# Altium schematic sheet Power.SchDoc
size A
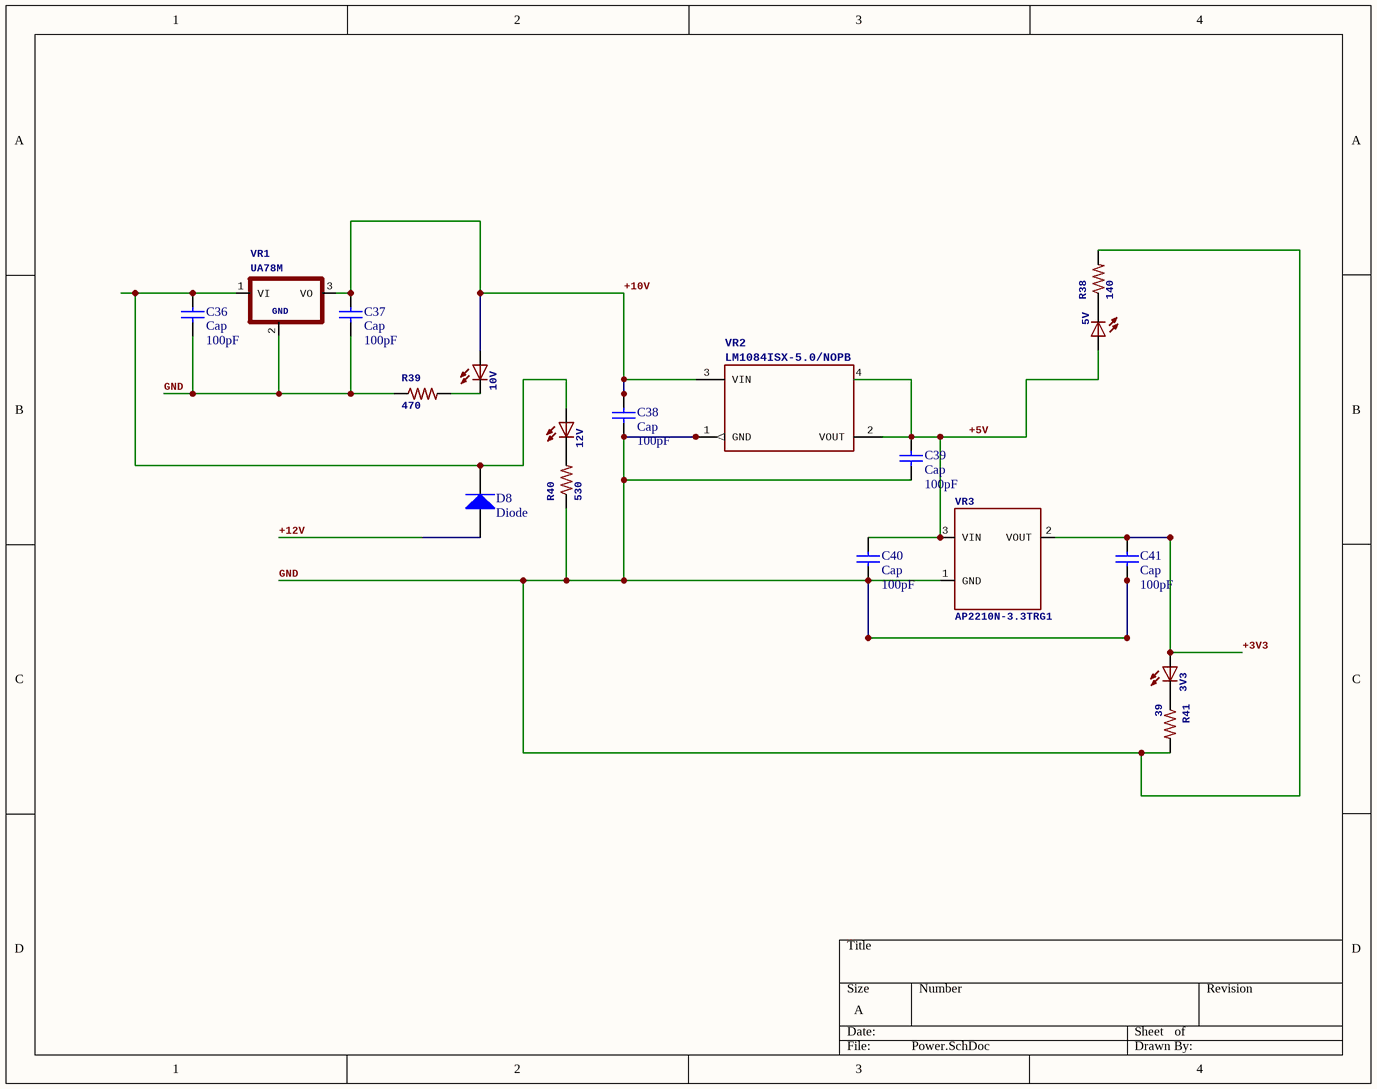
[diagram p0: Power.SchDoc]

## Parts
3V3  LED5MM  [LED5MM]  (value not drawn)
5V  LED5MM  [LED5MM]  (value not drawn)
10V  LED5MM  [LED5MM]  (value not drawn)
12V  LED5MM  [LED5MM]  (value not drawn)
C36  Cap  value 100pF  [CAPCP2012X06N]
C37  Cap  value 100pF  [CAPCP2012X06N]
C38  Cap  value 100pF  [CAPCP2012X06N]
C39  Cap  value 100pF  [CAPCP2012X06N]
C40  Cap  value 100pF  [CAPCP2012X06N]
C41  Cap  value 100pF  [CAPCP2012X06N]
D8  Diode  [DIODE-0.7]
R38  140  [RESC_0805_2012]
R39  470  [RESC_0805_2012]
R40  530  [RESC_0805_2012]
R41  39  [RESC_0805_2012]
VR1  UA78M  [UA78M]
VR2  LM1084ISX-5.0/NOPB  [LM1084ISX-5.0/NOPB]
VR3  AP2210N-3.3TRG1  [SOT95P245X110-3N]

## Nets
+3V3: 3V3.A C41.2 VR3.2(VOUT)
+5V: 5V.A C39.2 C40.2 VR2.2(VOUT) VR2.4 VR3.3(VIN)
+10V: 10V.A C37.2 C38.2 VR1.3(VO) VR2.3(VIN)
+12V: D8.1(A)
GND: C36.1 C37.1 C38.1 C39.1 C40.1 C41.1 R38.2 R39.1 R40.1 R41.2 VR1.2(GND) VR2.1(GND) VR3.1(GND)
Net3V3_K: 3V3.K(C) R41.1
Net5V_K: 5V.K(C) R38.1
Net10V_K: 10V.K(C) R39.2
Net12V_A: 12V.A C36.2 D8.2(K) VR1.1(VI)
Net12V_K: 12V.K(C) R40.2

## Library data of the parts
3V3 5V 10V 12V = LED5MM: LEDOSRAM:- CHIPLEDLG R971, LG N971, LY N971, LG Q971, LY Q971, LO R971, LY R971 LH N974, LH R974LS Q976, LO Q976, LY Q976LO Q996- Hyper CHIPLEDLW Q18SLB Q993, LB Q99A, LB R99A- SideLEDLS A670, LO A670, LY A670, LG A670, LP A670LB A673, LV A673, LT A673, LW A673LH A674LY A675LS A676, LA A676, LO A676, LY A676, LW A676LS A679, LY A679, LG A679-  Hyper Micro SIDELEDÂ®LS Y876, LA Y876, LO Y876, LY Y876LT Y87S- SmartLEDLW L88C, LW L88SLB L89C, LB L89S, LG L890LS L89K, LO L89K, LY L89KLS L896, LA L896, LO L896, LY L896- TOPLEDLS T670, LO T670, LY T670, LG T670, LP T670LSG T670, LSP T670, LSY T670, LOP T670, LYG T670LG T671, LOG T671, LSG T671LB T673, LV T673, LT T673, LW T673LH T674LS T676, LA T676, LO T676, LY T676, LB T676, LH T676, LSB T676, LW T676LB T67C, LV T67C, LT T67C, LS T67K, LO T67K, LY T67K, LW E67CLS E67B, LA E67B, LO E67B, LY E67B, LB E67C, LV E67C, LT E67CLW T67CLS T679, LY T679, LG T679LS T770, LO T770, LY T770, LG T770, LP T770LB T773, LV T773, LT T773, LW T773LH T774LS E675, LA E675, LY E675, LS T675LS T776, LA T776, LO T776, LY T776, LB T776LHGB T686LT T68C, LB T68C- Hyper Mini TOPLEDÂ®LB M676- Mini TOPLED SantanaÂ®LG M470LS M47K, LO M47K, LY M47K Source: http://www.osram.convergy.deLUXEON:- LUMILEDÂ®LXK2-PW12-R00, LXK2-PW12-S00, LXK2-PW14-U00, LXK2-PW14-V00LXK2-PM12-R00, LXK2-PM12-S00, LXK2-PM14-U00LXK2-PE12-Q00, LXK2-PE12-R00, LXK2-PE12-S00, LXK2-PE14-T00, LXK2-PE14-U00LXK2-PB12-K00, LXK2-PB12-L00, LXK2-PB12-M00, LXK2-PB14-N00, LXK2-PB14-P00, LXK2-PB14-Q00LXK2-PR12-L00, LXK2-PR12-M00, LXK2-PR14-Q00, LXK2-PR14-R00LXK2-PD12-Q00, LXK2-PD12-R00, LXK2-PD12-S00LXK2-PH12-R00, LXK2-PH12-S00LXK2-PL12-P00, LXK2-PL12-Q00, LXK2-PL12-R00 Source: www.luxeon.comKINGBRIGHT:KA-3528ASYCSource: www.kingbright.com; GateName_1: G$1; SymbolName_1: LED; DeviceName: 5MM; LibraryName: led; DeviceSetName: LED
C36-C41 = Cap: Capacitor; Published: 8-Jun-2000; LatestRevisionDate: 17-Jul-2002; LatestRevisionNote: Re-released for DXP Platform.; PackageReference: RAD-0.3; Publisher: Altium Limited; PackageDescription: Radial Cap, Thru-Hole; 2 Leads; 0.3 in Pin Spacing
D8 = Diode: Default Diode; Published: 8-Jun-2000; LatestRevisionDate: 17-Jul-2002; LatestRevisionNote: Re-released for DXP Platform.; PackageVersion: Sep-1996; PackageReference: SMC; Publisher: Altium Limited; PackageDescription: DO-214-AB/SMC; 2 C-Bend Leads; Body 7.9 x 5.9 mm, inc. leads (LxW); Code_JEDEC: DO-214-AB
R38-R41 = R-US_R0805: RESISTOR, American symbol; GateName_1: G$1; SymbolName_1: R-US; DeviceName: R0805; DeviceSetName: R-US_; LibraryName: resistor
VR1 = UA78M*: POSITIVE-VOLTAGE REGULATORS Source: http://focus.ti.com/lit/ds/symlink/ua78m33.pdf; GateName_1: G$1; SymbolName_1: 78XX2GND; LibraryName: texas-extra; DeviceSetName: UA78M*; GND: GND
VR2 = LM1084ISX-5.0/NOPB: MANUFACTURER_PART_NUMBER: LM1084ISX5.0NOPB; GateName_1: A; SymbolName_1: LM1084IS-5.0; VENDOR: Texas Instruments; LibraryName: texas-extra; DeviceSetName: LM1084ISX-5.0/NOPB
VR3 = AP2210N-3.3TRG1: 3.3V regulator300mA rating.; GateName_1: G$1; SymbolName_1: AP2210N-3.3TRG1; LibraryName: diodes-extra; DeviceSetName: AP2210N-3.3TRG1